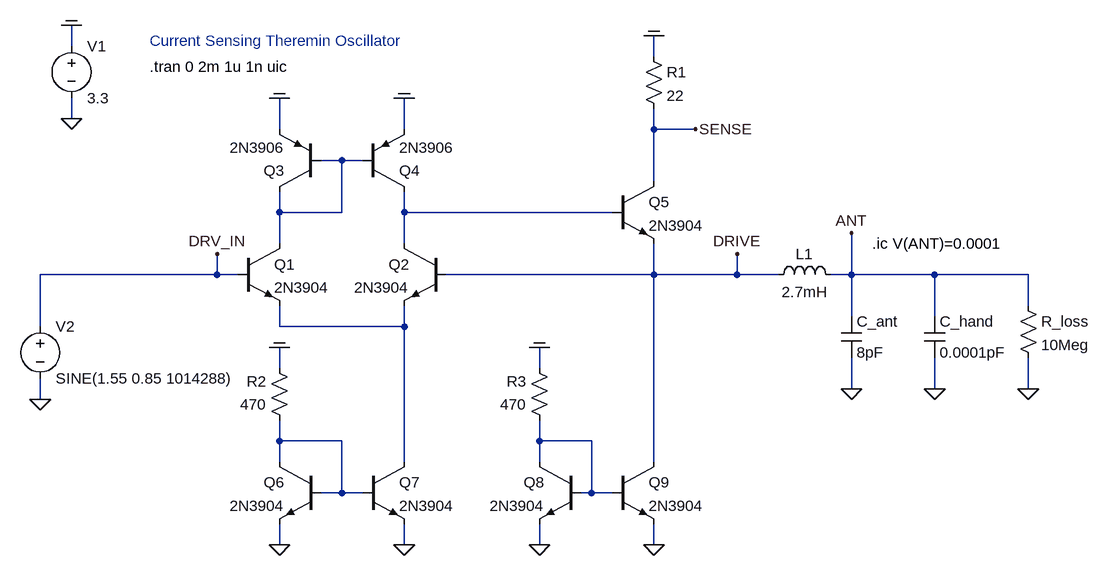
[diagram p0: schematic 2023_03_bjt_diff_amp_volt_follower_buffer_v01.asc]
2023_03_bjt_diff_amp_volt_follower_buffer_v01.asc, the LTspice schematic file:
Version 4
SHEET 1 16292 13396
WIRE 5744 9504 5744 9472
WIRE 6640 9520 6640 9488
WIRE 5744 9616 5744 9584
WIRE 6064 9632 6064 9584
WIRE 6256 9632 6256 9584
WIRE 6640 9632 6640 9600
WIRE 6704 9632 6640 9632
WIRE 6160 9680 6128 9680
WIRE 6192 9680 6160 9680
WIRE 6640 9712 6640 9632
WIRE 6064 9760 6064 9728
WIRE 6160 9760 6160 9680
WIRE 6160 9760 6064 9760
WIRE 6256 9760 6256 9728
WIRE 6576 9760 6256 9760
WIRE 6064 9808 6064 9760
WIRE 6256 9808 6256 9760
WIRE 5968 9856 5968 9824
WIRE 5968 9856 5696 9856
WIRE 6000 9856 5968 9856
WIRE 6640 9856 6640 9808
WIRE 6640 9856 6320 9856
WIRE 6768 9856 6768 9824
WIRE 6768 9856 6640 9856
WIRE 6832 9856 6768 9856
WIRE 6944 9856 6944 9792
WIRE 6944 9856 6912 9856
WIRE 7072 9856 6944 9856
WIRE 7216 9856 7072 9856
WIRE 7216 9904 7216 9856
WIRE 6944 9920 6944 9856
WIRE 7072 9920 7072 9856
WIRE 5696 9936 5696 9856
WIRE 6064 9936 6064 9904
WIRE 6256 9936 6256 9904
WIRE 6256 9936 6064 9936
WIRE 6064 10000 6064 9968
WIRE 6464 10000 6464 9968
WIRE 6944 10032 6944 9984
WIRE 7072 10032 7072 9984
WIRE 7216 10032 7216 9984
WIRE 5696 10048 5696 10016
WIRE 6064 10112 6064 10080
WIRE 6160 10112 6064 10112
WIRE 6464 10112 6464 10080
WIRE 6544 10112 6464 10112
WIRE 6064 10144 6064 10112
WIRE 6256 10144 6256 9936
WIRE 6464 10144 6464 10112
WIRE 6640 10144 6640 9856
WIRE 6160 10192 6160 10112
WIRE 6160 10192 6128 10192
WIRE 6192 10192 6160 10192
WIRE 6544 10192 6544 10112
WIRE 6544 10192 6528 10192
WIRE 6576 10192 6544 10192
WIRE 6064 10272 6064 10240
WIRE 6256 10272 6256 10240
WIRE 6464 10272 6464 10240
WIRE 6640 10272 6640 10240
FLAG 5744 9616 0
FLAG 5744 9472 COM
FLAG 6944 10032 0
FLAG 6944 9792 ANT
FLAG 7072 10032 0
FLAG 7216 10032 0
FLAG 6768 9824 DRIVE
FLAG 6256 10272 0
FLAG 6064 9584 COM
FLAG 6256 9584 COM
FLAG 6640 9488 COM
FLAG 6640 10272 0
FLAG 6464 10272 0
FLAG 6464 9968 COM
FLAG 6704 9632 SENSE
FLAG 5968 9824 DRV_IN
FLAG 6064 10272 0
FLAG 6064 9968 COM
FLAG 5696 10048 0
SYMBOL voltage 5744 9488 R0
WINDOW 123 0 0 Left 0
WINDOW 39 0 0 Left 0
SYMATTR InstName V1
SYMATTR Value 3.3
SYMBOL cap 6928 9920 R0
SYMATTR InstName C_ant
SYMATTR Value 8pF
SYMBOL cap 7056 9920 R0
SYMATTR InstName C_hand
SYMATTR Value 0.0001pF
SYMBOL res 7200 9888 R0
WINDOW 0 36 40 Left 2
WINDOW 3 36 76 Left 2
SYMATTR InstName R_loss
SYMATTR Value 10Meg
SYMBOL ind 6816 9872 R270
WINDOW 0 32 56 VTop 2
WINDOW 3 5 56 VBottom 2
SYMATTR InstName L1
SYMATTR Value 2.7mH
SYMATTR SpiceLine Ipk=0.5 Rser=120 Cpar=1.1pF
SYMBOL npn 6000 9808 R0
SYMATTR InstName Q1
SYMATTR Value 2N3904
SYMBOL npn 6320 9808 M0
SYMATTR InstName Q2
SYMATTR Value 2N3904
SYMBOL npn 6192 10144 R0
SYMATTR InstName Q7
SYMATTR Value 2N3904
SYMBOL pnp 6192 9728 M180
SYMATTR InstName Q4
SYMATTR Value 2N3906
SYMBOL pnp 6128 9728 R180
SYMATTR InstName Q3
SYMATTR Value 2N3906
SYMBOL npn 6576 9712 R0
SYMATTR InstName Q5
SYMATTR Value 2N3904
SYMBOL npn 6576 10144 R0
SYMATTR InstName Q9
SYMATTR Value 2N3904
SYMBOL npn 6528 10144 M0
SYMATTR InstName Q8
SYMATTR Value 2N3904
SYMBOL res 6624 9504 R0
WINDOW 0 36 40 Left 2
WINDOW 3 36 76 Left 2
SYMATTR InstName R1
SYMATTR Value 22
SYMBOL res 6480 10096 R180
WINDOW 0 36 76 Left 2
WINDOW 3 36 40 Left 2
SYMATTR InstName R3
SYMATTR Value 470
SYMBOL npn 6128 10144 M0
SYMATTR InstName Q6
SYMATTR Value 2N3904
SYMBOL res 6080 10096 R180
WINDOW 0 36 76 Left 2
WINDOW 3 36 40 Left 2
SYMATTR InstName R2
SYMATTR Value 470
SYMBOL voltage 5696 9920 R0
WINDOW 123 0 0 Left 0
WINDOW 39 0 0 Left 0
SYMATTR InstName V2
SYMATTR Value SINE(1.55 0.85 1014288)
TEXT 5864 9536 Left 2 !.tran 0 2m 1u 1n uic
TEXT 5864 9496 Left 2 ;Current Sensing Theremin Oscillator
TEXT 6976 9808 Left 2 !.ic V(ANT)=0.0001

The netlist it stands for:
* 2023_03_bjt_diff_amp_volt_follower_buffer_v01.asc
V1 COM 0 3.3
C_ant ANT 0 8pF
C_hand ANT 0 0.0001pF
R_loss ANT 0 10Meg
L1 DRIVE ANT 2.7mH Ipk=0.5 Rser=120 Cpar=1.1pF
Q1 N001 DRV_IN N003 0 2N3904
Q2 N002 DRIVE N003 0 2N3904
Q7 N003 N004 0 0 2N3904
Q4 N002 N001 COM 0 2N3906
Q3 N001 N001 COM 0 2N3906
Q5 SENSE N002 DRIVE 0 2N3904
Q9 DRIVE N005 0 0 2N3904
Q8 N005 N005 0 0 2N3904
R1 COM SENSE 22
R3 N005 COM 470
Q6 N004 N004 0 0 2N3904
R2 N004 COM 470
V2 DRV_IN 0 SINE(1.55 0.85 1014288)
.model NPN NPN
.model PNP PNP
.lib standard.bjt
.tran 0 2m 1u 1n uic
* Current Sensing Theremin Oscillator
.ic V(ANT)=0.0001
.backanno
.end